# Altium project MiniPTM.PrjPcb (part 3 of 3)

## Sheet 13-Power-P3V3.SchDoc
size B; SheetNumber: 12; SheetTotal: 14; SPICEModelCacheMBQUAUON: <root> / <DocumentId>MBQUAUON</DocumentId> / <CacheFrame Number="0"> / <Model Name="emk105bj105_v-f" Kind="CKT"> / <Text>* EMK105BJ105_V-F     SPICE MODEL  ( General Type ) / *-------------------------------------------------------------------------------------------------------- / * Model Generated by TAIYO YUDEN Corporation (http://www.ty-top.com) / * Version 1.0 / * TAIYO YUDEN Control No. 170508_130520 / * Copyright(c) 2012 TAIYO YUDEN CO.,LTD. All Rights Reserved. / *-------------------------------------------------------------------------------------------------------- / * / * Products Name : Multilayer Ceramic Capacitors / * / * Characteristics : / *     Capacitance : 1 uF , Rated Voltage : 16V , TCC : X5R / *     Case Size : 1.0 x 0.5 / 0.039 x 0.02 [mm/inch] , Thickness : 0.5 / 0.02 [mm/inch] / *     (Conditions: Temperature = 25 degC , DC Bias Current/Voltage = 0A / 0V) / * / * Frequency Range : 40Hz - 3GHz / * / * External Node Assignments : / * / *  1  o---| |---o  2 / * / *-------------------------------------------------------------------------------------------------------- / .SubCkt EMK105BJ105_V-F 1 2 / **************************** / C0 1 110 0.68309u / Cm 1 101 0.26053u / C1 101 102 0.94076u / Rc1 101 102 1.9029k / C2 102 103 0.66707u / Rc2 102 103 120.36 / C3 103 110 0.57203u / Rc3 103 110 2.1097 / C2m 1 301 0.1871u / C21 301 302 3.2494u / Rc21 301 302 1.1117k / C22 302 303 2.1014u / Rc22 302 303 1.484k / C23 303 304 2.1172u / Rc23 303 304 1.3876k / C24 304 305 0.75729u / Rc24 304 305 332.59 / C25 305 306 0.94401u / Rc25 305 306 249.09 / C26 306 307 0.34674u / Rc26 306 307 28.352 / C27 307 308 0.37158u / Rc27 307 308 19.989 / C28 308 309 0.17933u / Rc28 308 309 31.748 / C29 309 110 0.016445u / Rc29 309 110 1.0592 / Rp0 1 110 100Meg / L0 110 120 0.2216n / Lm 120 130 0.1509n / L1 120 121 0.12659n / RL1 121 130 0.85161 / L2 120 122 0.15996n / RL2 122 130 0.42469 / L3 120 123 7.9543n / RL3 123 130 0.54643m / CR 120 124 0.24334u / LR 124 125 0.090738n / RR 125 130 68.076m / CL 130 140 2.7354p / LL 130 140 0.10762n / RL 130 140 50.614 / Rs 140 2 7.5416m / **************************** / .ends EMK105BJ105_V-F</Text> / </Model> / </CacheFrame> / </root>
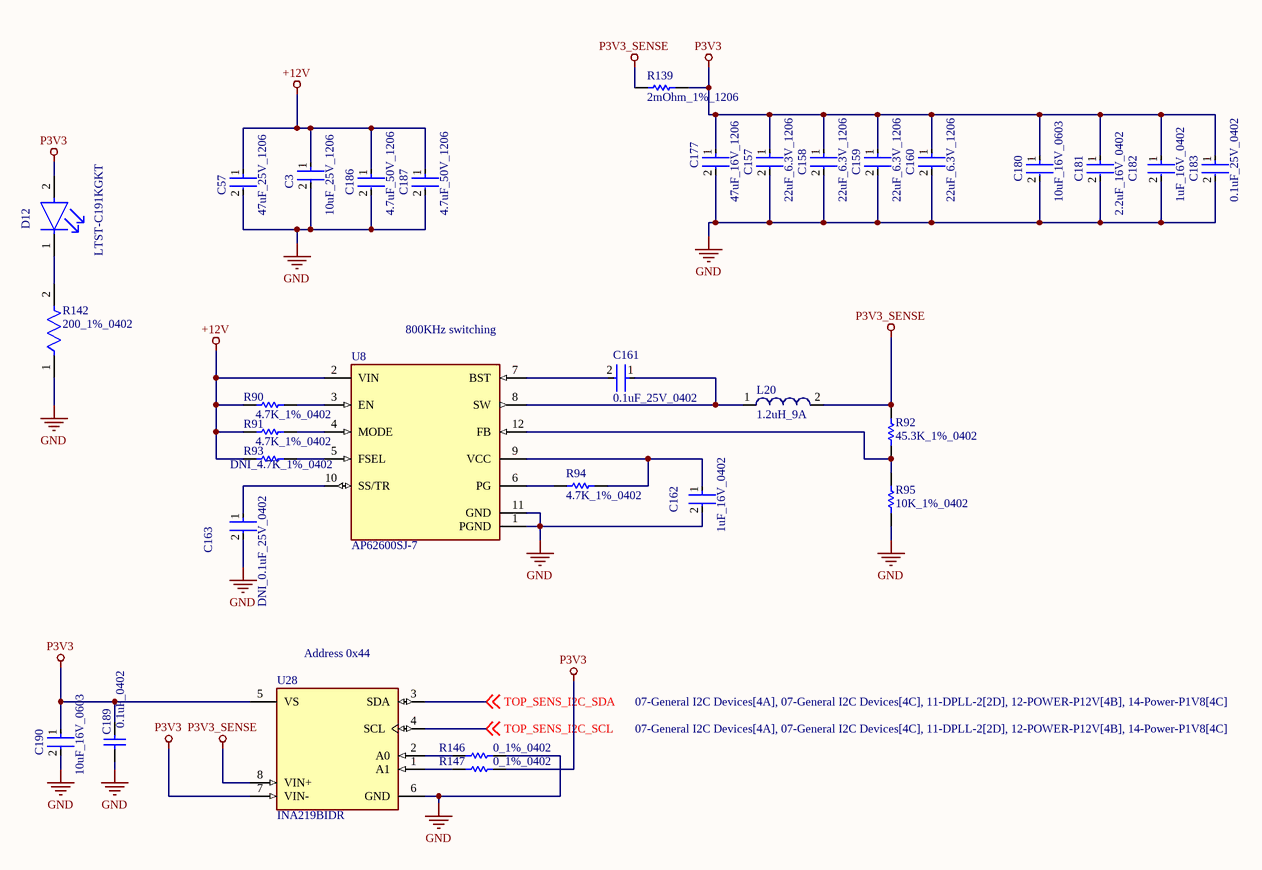
[diagram p11: 13-Power-P3V3.SchDoc]

### Parts
C3  10uF_25V_1206  [FP-1206-L_3_2_0_2-W_1_6_0-IPC_A]
C57  47uF_25V_1206  [FP-C3216-160-0_2-MFG]
C157  22uF_6.3V_1206  [FP-1206-L_3_2_0_2-W_1_6_0-IPC_C]
C158  22uF_6.3V_1206  [FP-1206-L_3_2_0_2-W_1_6_0-IPC_C]
C159  22uF_6.3V_1206  [FP-1206-L_3_2_0_2-W_1_6_0-IPC_C]
C160  22uF_6.3V_1206  [FP-1206-L_3_2_0_2-W_1_6_0-IPC_C]
C161  0.1uF_25V_0402  [FP-0402-L_1_0_1-W_0_5_0_1-IPC_C]
C162  1uF_16V_0402  [FP-0402-L_1_0_0_05-W_0_5-IPC_A]
C163  DNI_0.1uF_25V_0402  [FP-0402-L_1_0_1-W_0_5_0_1-IPC_C]  (no BOM)
C177  47uF_16V_1206  [FP-C3216-160-0_2-MFG]
C180  10uF_16V_0603  [FP-0603-L_1_6_0_2-W_0_8_0-MFG]
C181  2.2uF_16V_0402  [FP-C1005-050-0_05-IPC_A]
C182  1uF_16V_0402  [FP-0402-L_1_0_0_05-W_0_5-IPC_A]
C183  0.1uF_25V_0402  [FP-0402-L_1_0_1-W_0_5_0_1-IPC_C]
C186  4.7uF_50V_1206  [FP-GRM31C-0_2-e0_3_0_8-IPC_C]
C187  4.7uF_50V_1206  [FP-GRM31C-0_2-e0_3_0_8-IPC_C]
C189  0.1uF_0402  [CAPC1005X56X25NL10T15]
C190  10uF_16V_0603  [FP-0603-L_1_6_0_2-W_0_8_0-MFG]
D12  LTST-C191KGKT  [FP-LTST-C191KGKT-MFG]
L20  1.2uH_9A  [WE-LHMI 7050]
R90  4.7K_1%_0402  [RESC1005X40X25NL10T10]
R91  4.7K_1%_0402  [RESC1005X40X25NL10T10]
R92  45.3K_1%_0402  [RESC1005X40X25ML05T10]
R93  DNI_4.7K_1%_0402  [RESC1005X40X25NL10T10]  (no BOM)
R94  4.7K_1%_0402  [RESC1005X40X25NL10T10]
R95  10K_1%_0402  [RESC1005X40X25NL10T10]
R139  2mOhm_1%_1206  [RESC3216X89X64NL25T25]
R142  200_1%_0402  [FP-ERJ2RK-IPC_A]
R146  0_1%_0402  [RESC1005X40X25LL05T05]
R147  0_1%_0402  [RESC1005X40X25LL05T05]
U8  AP62600SJ-7  [FP-V-QFN2030-12_Type_A-MFG]
U28  INA219BIDR  [FP-D0008A-MFG]

### Nets
+12V: C3.1 C57.1 C186.1 C187.1 R90.1 R91.1 R93.1 U8.2(VIN)
GND: C3.2 C57.2 C157.2 C158.2 C159.2 C160.2 C162.2 C163.2 C177.2 C180.2 C181.2 C182.2 C183.2 C186.2 C187.2 C189.1 C190.2 R95.1 R142.1 R146.2 U8.1(PGND) U8.11(GND) U28.6(GND)
P3V3: C157.1 C158.1 C159.1 C160.1 C177.1 C180.1 C181.1 C182.1 C183.1 C189.2 C190.1 D12.2(A) R139.2 R147.2 U28.5(VS) U28.7(VIN-)
P3V3_SENSE: L20.2 R92.2 R139.1 U28.8(VIN+)
TOP_SENS_I2C_SCL: U28.4(SCL) ; off-sheet TOP_SENS_I2C_SCL
TOP_SENS_I2C_SDA: U28.3(SDA) ; off-sheet TOP_SENS_I2C_SDA
NetC161_1: C161.1 L20.1 U8.8(SW)
NetC161_2: C161.2 U8.7(BST)
NetC162_1: C162.1 R94.1 U8.9(VCC)
NetC163_1: C163.1 U8.10(SS/TR)
NetD12_1: D12.1(C) R142.2
NetR90_2: R90.2 U8.3(EN)
NetR91_2: R91.2 U8.4(MODE)
NetR92_1: R92.1 R95.2 U8.12(FB)
NetR93_2: R93.2 U8.5(FSEL)
NetR94_2: R94.2 U8.6(PG)
NetR146_1: R146.1 U28.2(A0)
NetR147_1: R147.1 U28.1(A1)

### Notes on the sheet
- (near U8) 800KHz switching
- (near U28) Address 0x44

### Library data of the parts
C3 = CMP-04427-006943-1: General Purpose Ceramic Capacitor, 1206, 10uF, 20%, X5R, 15%, 25V; Dissipation Factor: 12.5%; Insulation Resistance: 10GR; Case Code (Imperial): 1206; Series: -; Construction: Flat; Termination: SMD/SMT; Case/Package: 1206; Dielectric: X5R; Width: 1.6mm; Max Operating Temperature: 85°C; Height: 0.07mm; Package Quantity: 1; Depth: 1.6mm; Voltage Rating: 25V; Capacitance: 10uF; RoHS Compliant: Yes; Mount: Surface Mount; Radiation Hardening: No; Voltage Rating (DC): 25V; Number of Pins: 2; Contact Plating: Tin; Min Operating Temperature: -55°C; Lead Free: Lead Free; Packaging: Tape and Reel; Tolerance: 20%; Case Code (Metric): 3216; Thickness: 0.07inch; Length: 3.2mm; REACH SVHC: No SVHC
C57 = CMP-2000-05397-3: Multilayer Ceramic Capacitors 47uF ±20% 25V X5R SMD 1206; Weight: 0.000571oz; Dielectric: X5R; Length: 0.126inch; Voltage Rating: 25V; Case/Package: 1206; Dielectric Material: Ceramic; Min Operating Temperature: -55°C; Lead Free: Lead Free; Packaging: Tape and Reel; Package Quantity: 1; Mount: Surface Mount; Depth: 1.6mm; REACH SVHC: No SVHC; Termination: SMD/SMT; Case Code (Imperial): 1206; Series: C; Resistor Type: Ceramic; Voltage: 25V; Width: 0.063inch; Height: 1.6mm; Tolerance: 20%; Capacitance: 47uF; Max Operating Temperature: 85°C; Voltage Rating (DC): 25V; RoHS Compliant: Yes; Thickness: 0.071inch; Case Code (Metric): 3216
C157-C160 = CMP-2000-05869-2: General Purpose Ceramic Capacitor, 1206, 22uF, 20%, X5R, 15%, 6.3V; Lead Free: Lead Free; Case Code (Metric): 3216; Case/Package: 1206; Depth: 1.6mm; Capacitance: 22uF; Length: 3.2mm; Series: -; Contact Plating: Tin; Tolerance: 20%; REACH SVHC: No SVHC; Radiation Hardening: No; RoHS Compliant: Yes; Termination: SMD/SMT; Voltage Rating: 6.3V; Packaging: Tape and Reel; Voltage: 6.3V; Mount: Surface Mount; Thickness: 0.07inch; Package Quantity: 1; Voltage Rating (DC): 6.3V; Case Code (Imperial): 1206; Construction: Flat; Dielectric: X5R; Number of Pins: 2; Min Operating Temperature: -55°C; Height: 0.07mm; Width: 0.063inch; Max Operating Temperature: 85°C
C161 C163 C183 = CMP-2008-02519-2: General Purpose Ceramic Capacitor, 0402, 100nF, 10%, X7R, 15%, 25V; Package Quantity: 1; Capacitance: 100nF; Min Operating Temperature: -55°C; Voltage: 25V; Voltage Rating: 25V; Construction: Flat; Max Operating Temperature: 125°C; Radiation Hardening: No; Depth: 0.5mm; Thickness: 0.022inch; Voltage Rating (DC): 25V; Number of Pins: 2; Lead Free: Lead Free; Series: -; REACH SVHC: No SVHC; Length: 1mm; Dielectric: X7R; RoHS Compliant: Yes; Mount: Surface Mount; Packaging: Tape and Reel; Case/Package: 0402; Case Code (Imperial): 0402; Termination: SMD/SMT; Width: 0.02inch; Case Code (Metric): 1005; Tolerance: 10%
C162 C182 = CMP-14477-000104-2: None; Tolerance: 10%; Voltage Rating: 16V; Dielectric: X5R; Capacitance: 1uF; Packaging: Tape and Reel; Depth: 0.5mm; Mount: Surface Mount; Thickness: 0.022inch; Package Quantity: 1; Min Operating Temperature: -55°C; Series: M; Voltage Rating (DC): 16V; Termination: SMD/SMT; Case/Package: 0402; Number of Pins: 2; Case Code (Imperial): 0402; Length: 1mm; Halogen Free: Halogen Free; Case Code (Metric): 1005; Width: 0.02inch; RoHS Compliant: Yes; Radiation Hardening: No; Max Operating Temperature: 85°C; Height: 0.5mm; Construction: Flat
C177 = CMP-2000-07442-2: Multilayer Ceramic Capacitors 47uF ±20% 16V X5R SMD 1206; Resistor Type: Ceramic; Width: 0.063inch; Case Code (Imperial): 1206; Radiation Hardening: No; Thickness: 0.071inch; Dielectric: X5R; Weight: 0.000571oz; Termination: SMD/SMT; Dielectric Material: Ceramic; Min Operating Temperature: -55°C; Depth: 1.6mm; Case Code (Metric): 3216; Max Operating Temperature: 85°C; RoHS Compliant: Yes; REACH SVHC: No SVHC; Mount: Surface Mount; Lead Free: Lead Free; Height: 1.6mm; Length: 3.2mm; Tolerance: 20%; Voltage Rating (DC): 16V; Capacitance: 47uF; Package Quantity: 1; Construction: Flat; Packaging: Tape and Reel; Series: C; Case/Package: 1206; Voltage Rating: 16V
C180 C190 = CMP-2000-06226-4: Multilayer Ceramic Capacitor 10uF 16V X5R 20% SMD 0603 T/R; Packaging: Tape and Reel; Construction: Flat; Height: 0.8mm; Max Operating Temperature: 85°C; Dielectric: X5R; Case Code (Metric): 1608; Voltage Rating (DC): 16V; Width: 0.031inch; Voltage Rating: 16V; Length: 0.063inch; RoHS Compliant: Yes; Halogen Free: Halogen Free; Case Code (Imperial): 0603; Capacitance: 10uF; Mount: Surface Mount; Thickness: 0.031inch; Tolerance: 20%; Min Operating Temperature: -55°C; Series: M; Termination: SMD/SMT; Case/Package: 0603; Package Quantity: 1
C181 = CMP-2000-05998-2: Multilayer Ceramic Capacitors 2.2μF ±10% 16V X5R SMD 0402; Capacitance: 2.2uF; REACH SVHC: No SVHC; Series: C; Termination: SMD/SMT; Case Code (Imperial): 0402; Depth: 0.5mm; Mount: Surface Mount; Width: 0.02inch; Package Quantity: 1; Dielectric Material: Ceramic; Length: 1mm; Packaging: Tape and Reel; Case Code (Metric): 1005; RoHS Compliant: Yes; Dielectric: X5R; Max Operating Temperature: 85°C; Lead Free: Lead Free; Weight: 2.3E-05oz; Thickness: 0.022inch; Voltage Rating (DC): 16V; Tolerance: 10%; Voltage Rating: 16V; Resistor Type: Ceramic; Height: 0.5mm; Case/Package: 0402; Min Operating Temperature: -55°C
C186 C187 = CMP-1037-04923-3: Chip Multilayer Ceramic Capacitors for General Purpose, 1206, 4.7uF, X7R, 15%, 10%, 50V; Height: 1.6mm; Voltage: 50V; Capacitance: 4.7uF; Lead Free: Lead Free; Max Operating Temperature: 125°C; Packaging: Tape and Reel; REACH SVHC: No SVHC; Voltage Rating: 50V; Mount: Surface Mount; Termination: SMD/SMT; Tolerance: 10%; Case/Package: 1206; Material: Ceramic; Depth: 1.6mm; Length: 3.2mm; Case Code (Metric): 3216; Voltage Rating (DC): 50V; Case Code (Imperial): 1206; Radiation Hardening: No; Width: 0.063inch; Thickness: 0.071inch; Package Quantity: 2000; Min Operating Temperature: -55°C; Dielectric: X7R
C189 = CMP-2008-00031-1: Part Number: LD02YD104KAB2A; Manufacturer: AVX Interconnect / Elco
D12 = CMP-2000-05198-2: LED GREEN CLEAR SMD; Max Power Dissipation: 75mW; Forward Current: 30mA; Reverse Voltage: 5V; Lens Color: Colorless; Forward Voltage: 2V; Dominant Wavelength: 571nm; Number of LEDs: 1; Viewing Angle: 130°; Lens Style: Rectangular; Test Current: 20mA; Luminous Intensity: 35mcd; Wavelength: 574nm; Width: 0.8mm; Case Code (Imperial): 0603; Number of Pins: 2; Lead Free: Lead Free; Packaging: Tape and Reel; Package Quantity: 1; Min Operating Temperature: -55°C; Case/Package: 0603; Length: 1.6mm; Power Dissipation: 75mW; Depth: 0.8mm; Radiation Hardening: No; Mount: Surface Mount; Max Operating Temperature: 85°C; Color: Green; Power Rating: 75mW; Height: 0.55mm; Illumination Color: Green; Case Code (Metric): 1608; Lens Transparency: Clear; Number of Elements: 1
L20 = CMP-1353-00066-2: SMD Power Inductor WE-LHMI, L=1.2 µH; Manufacturer: Wuerth Elektronik; PartNumber: 74437349012; Inductance: 1.2 ÂµH; ComponentLink1Description: Manufacturer URL; ComponentLink2URL: http://katalog.we-online.de/kataloge/eisos/media/pdf/74437349012.pdf; ComponentLink1URL: http://www.we-online.com; PackageReference: WE-LHMI 7050; ComponentLink2Description: Datasheet
R90 R91 R93 R94 = CMP-2002-05217-1: as R82-R84 on sheet 11-DPLL-2
R92 = CMP-2002-07692-1: Part Number: RC0402FR-0745K3L; Manufacturer: Yageo / Phycomp
R95 = CMP-2002-04694-1: Manufacturer: Bourns; Part Number: CR0402-FX-1002GLF
R139 = CMP-2003-04334-1: Manufacturer: Vishay Dale; Part Number: WSL12062L000FEA18
R142 = CMP-2002-00757-2: RES SMD 200 OHM 1% 1/10W 0402; Power Rating: 100mW; Voltage Rating (DC): 50V; Resistance: 200R; Temperature Coefficient: 100ppm/°C; RoHS Compliant: Yes; Packaging: Tape and Reel; Case Code (Metric): 1005; Package Quantity: 1; Contact Plating: Tin; Series: ERJ; Mount: Surface Mount; Lead Free: Lead Free; Min Operating Temperature: -55°C; Number of Terminations: 2; Max Power Dissipation: 100mW; Technology: THICK FILM; Voltage Rating: 50V; Case/Package: 0402; Width: 0.02inch; Termination: SMD/SMT; Military Standard: Not; Height: 0.35mm; Radiation Hardening: No; Resistance Tolerance: 1%; Length: 1mm; REACH SVHC: No SVHC; Construction: Rectangular; Depth: 0.5mm; Features: Automotive AEC-Q200; Resistor Type: Thick Film; Case Code (Imperial): 0402; Tolerance: 1%; Size Code: 0402; Max Operating Temperature: 155°C
R146 R147 = CMP-2000-07451-1: Chip Resistor, 0 Ohm, 0.1 W, -55 to 155 degC, 0402 (1005 Metric), RoHS, Tape and Reel; Manufacturer: Panasonic; Voltage Rating (DC): 50V; Temperature Coefficient: 600ppm/��C; Max Power Dissipation: 100mW; Resistance: 0mOhm; Tolerance: 5%; Number of Terminations: 2; Mount: SurfaceMount; Height: 0.35mm; Packaging: TapeandReel; Contact Plating: Tin; Manufacturer URL: http://www.panasonic.com/; Composition: ThickFilm; Max Operating Temperature: 155degC; REACH SVHC: NoSVHC; Case/Package: 0402; Package Reference: 402; Depth: 0.5mm; Package Description: 2-Pin Surface Mount Device, Body 1 x 0.5 mm; Datasheet URL: https://industrial.panasonic.com/cdbs/www-data/pdf/RDA0000/AOA0000C301.pdf; RoHSCompliant: True; Case Code (Imperial): 0402; Military Standard: Not; Min Operating Temperature: -55degC; Power Rating: 100mW; Datasheet Version: 03/2015; Length: 1mm; Case Code (Metric): 1005; Termination: SMD/SMT; Mounting Technology: SurfaceMount; Voltage Rating: 50V; Width: 0.02inch; Package Quantity: 1; Lead Free: LeadFree; Radiation Hardening: No
U8 = CMP-12757-000022-1: DCDC CONV HV BUCK,V-QFN2030-12; RoHS Compliant: Yes
U28 = CMP-0704-00005-3: IC MONITOR PWR/CURR BIDIR 8-SOIC; Min Supply Voltage: 3V; Common Mode Rejection Ratio: 100dB; Output Current: 10mA; Number of Amplifiers: 1; Accuracy: 0.5%; Supply Current: 1mA; Quiescent Current: 700uA; Bandwidth: 11kHz; Input Offset Voltage (Vos): 40uV; Max Supply Voltage: 5.5V; Packaging: Tape and Reel; REACH SVHC: No SVHC; Max Operating Temperature: 125°C; Number of Pins: 8; Lead Free: Lead Free; Package Quantity: 1; Radiation Hardening: No; Case/Package: SOIC; Min Operating Temperature: -40°C; Contact Plating: Gold; Series: Zero-Drift; Nominal Supply Current: 1mA; RoHS Compliant: Yes

## Sheet 14-Power-P1V8.SchDoc
size B; SheetNumber: 12; SheetTotal: 12; SPICEModelCachePRDMSQGY: <root> / <DocumentId>PRDMSQGY</DocumentId> / <CacheFrame Number="0"> / <Model Name="emk105bj105_v-f" Kind="CKT"> / <Text>* EMK105BJ105_V-F     SPICE MODEL  ( General Type ) / *-------------------------------------------------------------------------------------------------------- / * Model Generated by TAIYO YUDEN Corporation (http://www.ty-top.com) / * Version 1.0 / * TAIYO YUDEN Control No. 170508_130520 / * Copyright(c) 2012 TAIYO YUDEN CO.,LTD. All Rights Reserved. / *-------------------------------------------------------------------------------------------------------- / * / * Products Name : Multilayer Ceramic Capacitors / * / * Characteristics : / *     Capacitance : 1 uF , Rated Voltage : 16V , TCC : X5R / *     Case Size : 1.0 x 0.5 / 0.039 x 0.02 [mm/inch] , Thickness : 0.5 / 0.02 [mm/inch] / *     (Conditions: Temperature = 25 degC , DC Bias Current/Voltage = 0A / 0V) / * / * Frequency Range : 40Hz - 3GHz / * / * External Node Assignments : / * / *  1  o---| |---o  2 / * / *-------------------------------------------------------------------------------------------------------- / .SubCkt EMK105BJ105_V-F 1 2 / **************************** / C0 1 110 0.68309u / Cm 1 101 0.26053u / C1 101 102 0.94076u / Rc1 101 102 1.9029k / C2 102 103 0.66707u / Rc2 102 103 120.36 / C3 103 110 0.57203u / Rc3 103 110 2.1097 / C2m 1 301 0.1871u / C21 301 302 3.2494u / Rc21 301 302 1.1117k / C22 302 303 2.1014u / Rc22 302 303 1.484k / C23 303 304 2.1172u / Rc23 303 304 1.3876k / C24 304 305 0.75729u / Rc24 304 305 332.59 / C25 305 306 0.94401u / Rc25 305 306 249.09 / C26 306 307 0.34674u / Rc26 306 307 28.352 / C27 307 308 0.37158u / Rc27 307 308 19.989 / C28 308 309 0.17933u / Rc28 308 309 31.748 / C29 309 110 0.016445u / Rc29 309 110 1.0592 / Rp0 1 110 100Meg / L0 110 120 0.2216n / Lm 120 130 0.1509n / L1 120 121 0.12659n / RL1 121 130 0.85161 / L2 120 122 0.15996n / RL2 122 130 0.42469 / L3 120 123 7.9543n / RL3 123 130 0.54643m / CR 120 124 0.24334u / LR 124 125 0.090738n / RR 125 130 68.076m / CL 130 140 2.7354p / LL 130 140 0.10762n / RL 130 140 50.614 / Rs 140 2 7.5416m / **************************** / .ends EMK105BJ105_V-F</Text> / </Model> / </CacheFrame> / </root>
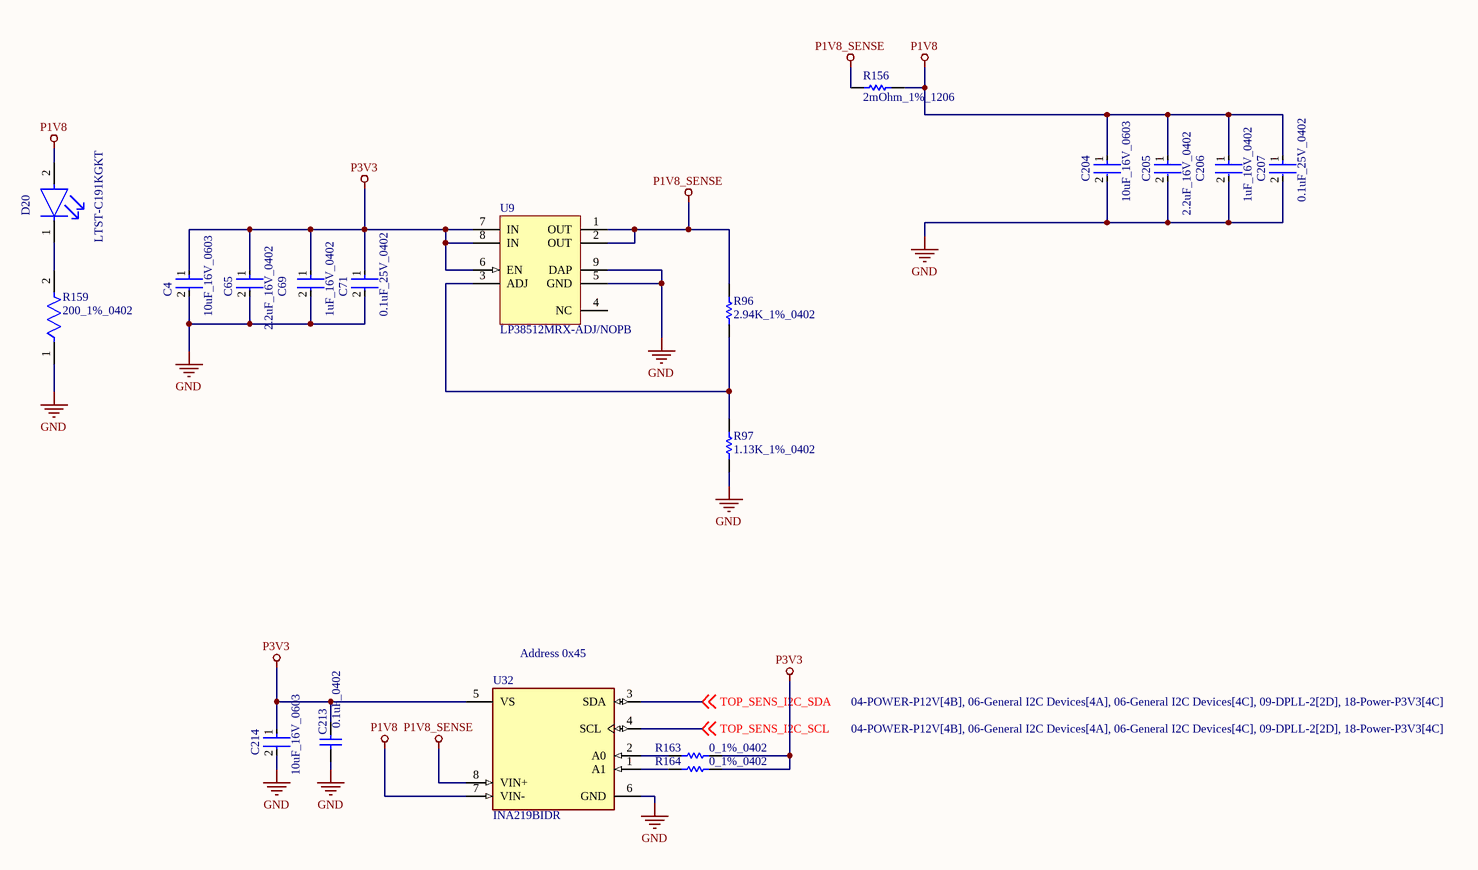
[diagram p12: 14-Power-P1V8.SchDoc]

### Parts
C4  10uF_16V_0603  [FP-0603-L_1_6_0_2-W_0_8_0-MFG]
C65  2.2uF_16V_0402  [FP-C1005-050-0_05-IPC_A]
C69  1uF_16V_0402  [FP-0402-L_1_0_0_05-W_0_5-IPC_A]
C71  0.1uF_25V_0402  [FP-0402-L_1_0_1-W_0_5_0_1-IPC_C]
C204  10uF_16V_0603  [FP-0603-L_1_6_0_2-W_0_8_0-MFG]
C205  2.2uF_16V_0402  [FP-C1005-050-0_05-IPC_A]
C206  1uF_16V_0402  [FP-0402-L_1_0_0_05-W_0_5-IPC_A]
C207  0.1uF_25V_0402  [FP-0402-L_1_0_1-W_0_5_0_1-IPC_C]
C213  0.1uF_0402  [CAPC1005X56X25NL10T15]
C214  10uF_16V_0603  [FP-0603-L_1_6_0_2-W_0_8_0-MFG]
D20  LTST-C191KGKT  [FP-LTST-C191KGKT-MFG]
R96  2.94K_1%_0402  [RESC1005X40X25ML05T10]
R97  1.13K_1%_0402  [RESC1005X40X25NL05T05]
R156  2mOhm_1%_1206  [RESC3216X89X64NL25T25]
R159  200_1%_0402  [FP-ERJ2RK-IPC_A]
R163  0_1%_0402  [RESC1005X40X25LL05T05]
R164  0_1%_0402  [RESC1005X40X25LL05T05]
U9  LP38512MRX-ADJ/NOPB  [MRA08B_M]
U32  INA219BIDR  [FP-D0008A-MFG]

### Nets
GND: C4.2 C65.2 C69.2 C71.2 C204.2 C205.2 C206.2 C207.2 C213.1 C214.2 R97.1 R159.1 U9.5(GND) U9.9(DAP) U32.6(GND)
P1V8: C204.1 C205.1 C206.1 C207.1 D20.2(A) R156.2 U32.7(VIN-)
P1V8_SENSE: R96.2 R156.1 U9.1(OUT) U9.2(OUT) U32.8(VIN+)
P3V3: C4.1 C65.1 C69.1 C71.1 C213.2 C214.1 R163.2 R164.2 U9.6(EN) U9.7(IN) U9.8(IN) U32.5(VS)
TOP_SENS_I2C_SCL: U32.4(SCL) ; off-sheet TOP_SENS_I2C_SCL
TOP_SENS_I2C_SDA: U32.3(SDA) ; off-sheet TOP_SENS_I2C_SDA
NetD20_1: D20.1(C) R159.2
NetR96_1: R96.1 R97.2 U9.3(ADJ)
NetR163_1: R163.1 U32.2(A0)
NetR164_1: R164.1 U32.1(A1)

Not connected (* = marked no-connect by the designer): U9 4(NC)

### Notes on the sheet
- (near U32) Address 0x45

### Library data of the parts
C4 C204 C214 = CMP-2000-06226-4: as C180 on sheet 13-Power-P3V3; Packaging: Tape and Reel; Construction: Flat; Height: 0.8mm; Max Operating Temperature: 85°C; Dielectric: X5R; Case Code (Metric): 1608; Voltage Rating (DC): 16V; Width: 0.031inch; Voltage Rating: 16V; Length: 0.063inch; RoHS Compliant: Yes; Halogen Free: Halogen Free; Case Code (Imperial): 0603; Capacitance: 10uF; Mount: Surface Mount; Thickness: 0.031inch; Tolerance: 20%; Min Operating Temperature: -55°C; Series: M; Termination: SMD/SMT; Case/Package: 0603; Package Quantity: 1
C65 C205 = CMP-2000-05998-2: as C181 on sheet 13-Power-P3V3; REACH SVHC: No SVHC; Series: C; Termination: SMD/SMT; Case Code (Imperial): 0402; Depth: 0.5mm; Mount: Surface Mount; Width: 0.02inch; Package Quantity: 1; Dielectric Material: Ceramic; Length: 1mm; Packaging: Tape and Reel; Case Code (Metric): 1005; RoHS Compliant: Yes; Dielectric: X5R; Max Operating Temperature: 85°C; Lead Free: Lead Free; Weight: 2.3E-05oz; Thickness: 0.022inch; Voltage Rating (DC): 16V; Tolerance: 10%; Voltage Rating: 16V; Resistor Type: Ceramic; Height: 0.5mm; Case/Package: 0402; Min Operating Temperature: -55°C
C69 C206 = CMP-14477-000104-2: as C162 on sheet 13-Power-P3V3; Packaging: Tape and Reel; Depth: 0.5mm; Mount: Surface Mount; Thickness: 0.022inch; Package Quantity: 1; Min Operating Temperature: -55°C; Series: M; Voltage Rating (DC): 16V; Termination: SMD/SMT; Case/Package: 0402; Number of Pins: 2; Case Code (Imperial): 0402; Length: 1mm; Halogen Free: Halogen Free; Case Code (Metric): 1005; Width: 0.02inch; RoHS Compliant: Yes; Radiation Hardening: No; Max Operating Temperature: 85°C; Height: 0.5mm; Construction: Flat
C71 C207 = CMP-2008-02519-2: as C161 on sheet 13-Power-P3V3; Package Quantity: 1; Capacitance: 100nF; Min Operating Temperature: -55°C; Voltage: 25V; Voltage Rating: 25V; Construction: Flat; Max Operating Temperature: 125°C; Radiation Hardening: No; Depth: 0.5mm; Thickness: 0.022inch; Voltage Rating (DC): 25V; Number of Pins: 2; Lead Free: Lead Free; Series: -; REACH SVHC: No SVHC; Length: 1mm; Dielectric: X7R; RoHS Compliant: Yes; Mount: Surface Mount; Packaging: Tape and Reel; Case/Package: 0402; Case Code (Imperial): 0402; Termination: SMD/SMT; Width: 0.02inch; Case Code (Metric): 1005; Tolerance: 10%
C213 = CMP-2008-00031-1: as C189 on sheet 13-Power-P3V3
D20 = CMP-2000-05198-2: as D12 on sheet 13-Power-P3V3; Width: 0.8mm; Case Code (Imperial): 0603; Number of Pins: 2; Lead Free: Lead Free; Packaging: Tape and Reel; Package Quantity: 1; Min Operating Temperature: -55°C; Case/Package: 0603; Length: 1.6mm; Power Dissipation: 75mW; Depth: 0.8mm; Radiation Hardening: No; Mount: Surface Mount; Max Operating Temperature: 85°C; Color: Green; Power Rating: 75mW; Height: 0.55mm; Illumination Color: Green; Case Code (Metric): 1608; Lens Transparency: Clear; Number of Elements: 1
R96 = CMP-2002-07579-1: Manufacturer: Yageo; Part Number: RC0402FR-072K94L
R97 = CMP-2002-00630-1: Manufacturer: Panasonic; Part Number: ERJ-2RKF1131X
R156 = CMP-2003-04334-1: as R139 on sheet 13-Power-P3V3
R159 = CMP-2002-00757-2: as R142 on sheet 13-Power-P3V3; RoHS Compliant: Yes; Packaging: Tape and Reel; Case Code (Metric): 1005; Package Quantity: 1; Contact Plating: Tin; Series: ERJ; Mount: Surface Mount; Lead Free: Lead Free; Min Operating Temperature: -55°C; Number of Terminations: 2; Max Power Dissipation: 100mW; Technology: THICK FILM; Voltage Rating: 50V; Case/Package: 0402; Width: 0.02inch; Termination: SMD/SMT; Military Standard: Not; Height: 0.35mm; Radiation Hardening: No; Resistance Tolerance: 1%; Length: 1mm; REACH SVHC: No SVHC; Construction: Rectangular; Depth: 0.5mm; Features: Automotive AEC-Q200; Resistor Type: Thick Film; Case Code (Imperial): 0402; Tolerance: 1%; Size Code: 0402; Max Operating Temperature: 155°C
R163 R164 = CMP-2000-07451-1: as R146 on sheet 13-Power-P3V3; Number of Terminations: 2; Mount: SurfaceMount; Height: 0.35mm; Packaging: TapeandReel; Contact Plating: Tin; Manufacturer URL: http://www.panasonic.com/; Composition: ThickFilm; Max Operating Temperature: 155degC; REACH SVHC: NoSVHC; Case/Package: 0402; Package Reference: 402; Depth: 0.5mm; Package Description: 2-Pin Surface Mount Device, Body 1 x 0.5 mm; Datasheet URL: https://industrial.panasonic.com/cdbs/www-data/pdf/RDA0000/AOA0000C301.pdf; RoHSCompliant: True; Case Code (Imperial): 0402; Military Standard: Not; Min Operating Temperature: -55degC; Power Rating: 100mW; Datasheet Version: 03/2015; Length: 1mm; Case Code (Metric): 1005; Termination: SMD/SMT; Mounting Technology: SurfaceMount; Voltage Rating: 50V; Width: 0.02inch; Package Quantity: 1; Lead Free: LeadFree; Radiation Hardening: No
U9 = CMP-0062-01039-2: 1.5A Fast-Transient Response Adjustable Low-Dropout Linear Voltage Regulator, 8-pin PSOP, Pb-Free; Manufacturer: National Semiconductor; CompType: LDO IC; PackageTopMarking: NSXYTT*L38512*-ADJ; PowerWise: N; ComponentLink3URL: http://www.national.com/packaging/folders/mra08b.html; PackageReference: MRA08B; RoHS: Y; DatasheetVersion: Feb-2009; ComponentLink2Description: LP38512 Web Page; PackageDescription: Molded, PSOP .193 x .154 x .058in, 8 Lead, .050in Pitch, Large DAP; ComponentLink1URL: http://www.national.com/ds/LP/LP38512-ADJ.pdf; ComponentLink3Description: MRA08B Package Page; ComponentLink1Description: LP38512 Datasheet; PackageVersion: revB, Dec-2007; ComponentLink2URL: http://www.national.com/pf/LP/LP38512.html; Code_JEDEC: MS-012-AA; PinCount: 8; RevisionNote: Component URLs added
U32 = CMP-0704-00005-3: as U28 on sheet 13-Power-P3V3; Packaging: Tape and Reel; REACH SVHC: No SVHC; Max Operating Temperature: 125°C; Number of Pins: 8; Lead Free: Lead Free; Package Quantity: 1; Radiation Hardening: No; Case/Package: SOIC; Min Operating Temperature: -40°C; Contact Plating: Gold; Series: Zero-Drift; Nominal Supply Current: 1mA; RoHS Compliant: Yes

## Sheet 15-M2_GNSS.SchDoc
size B; SheetNumber: 13; SheetTotal: 13
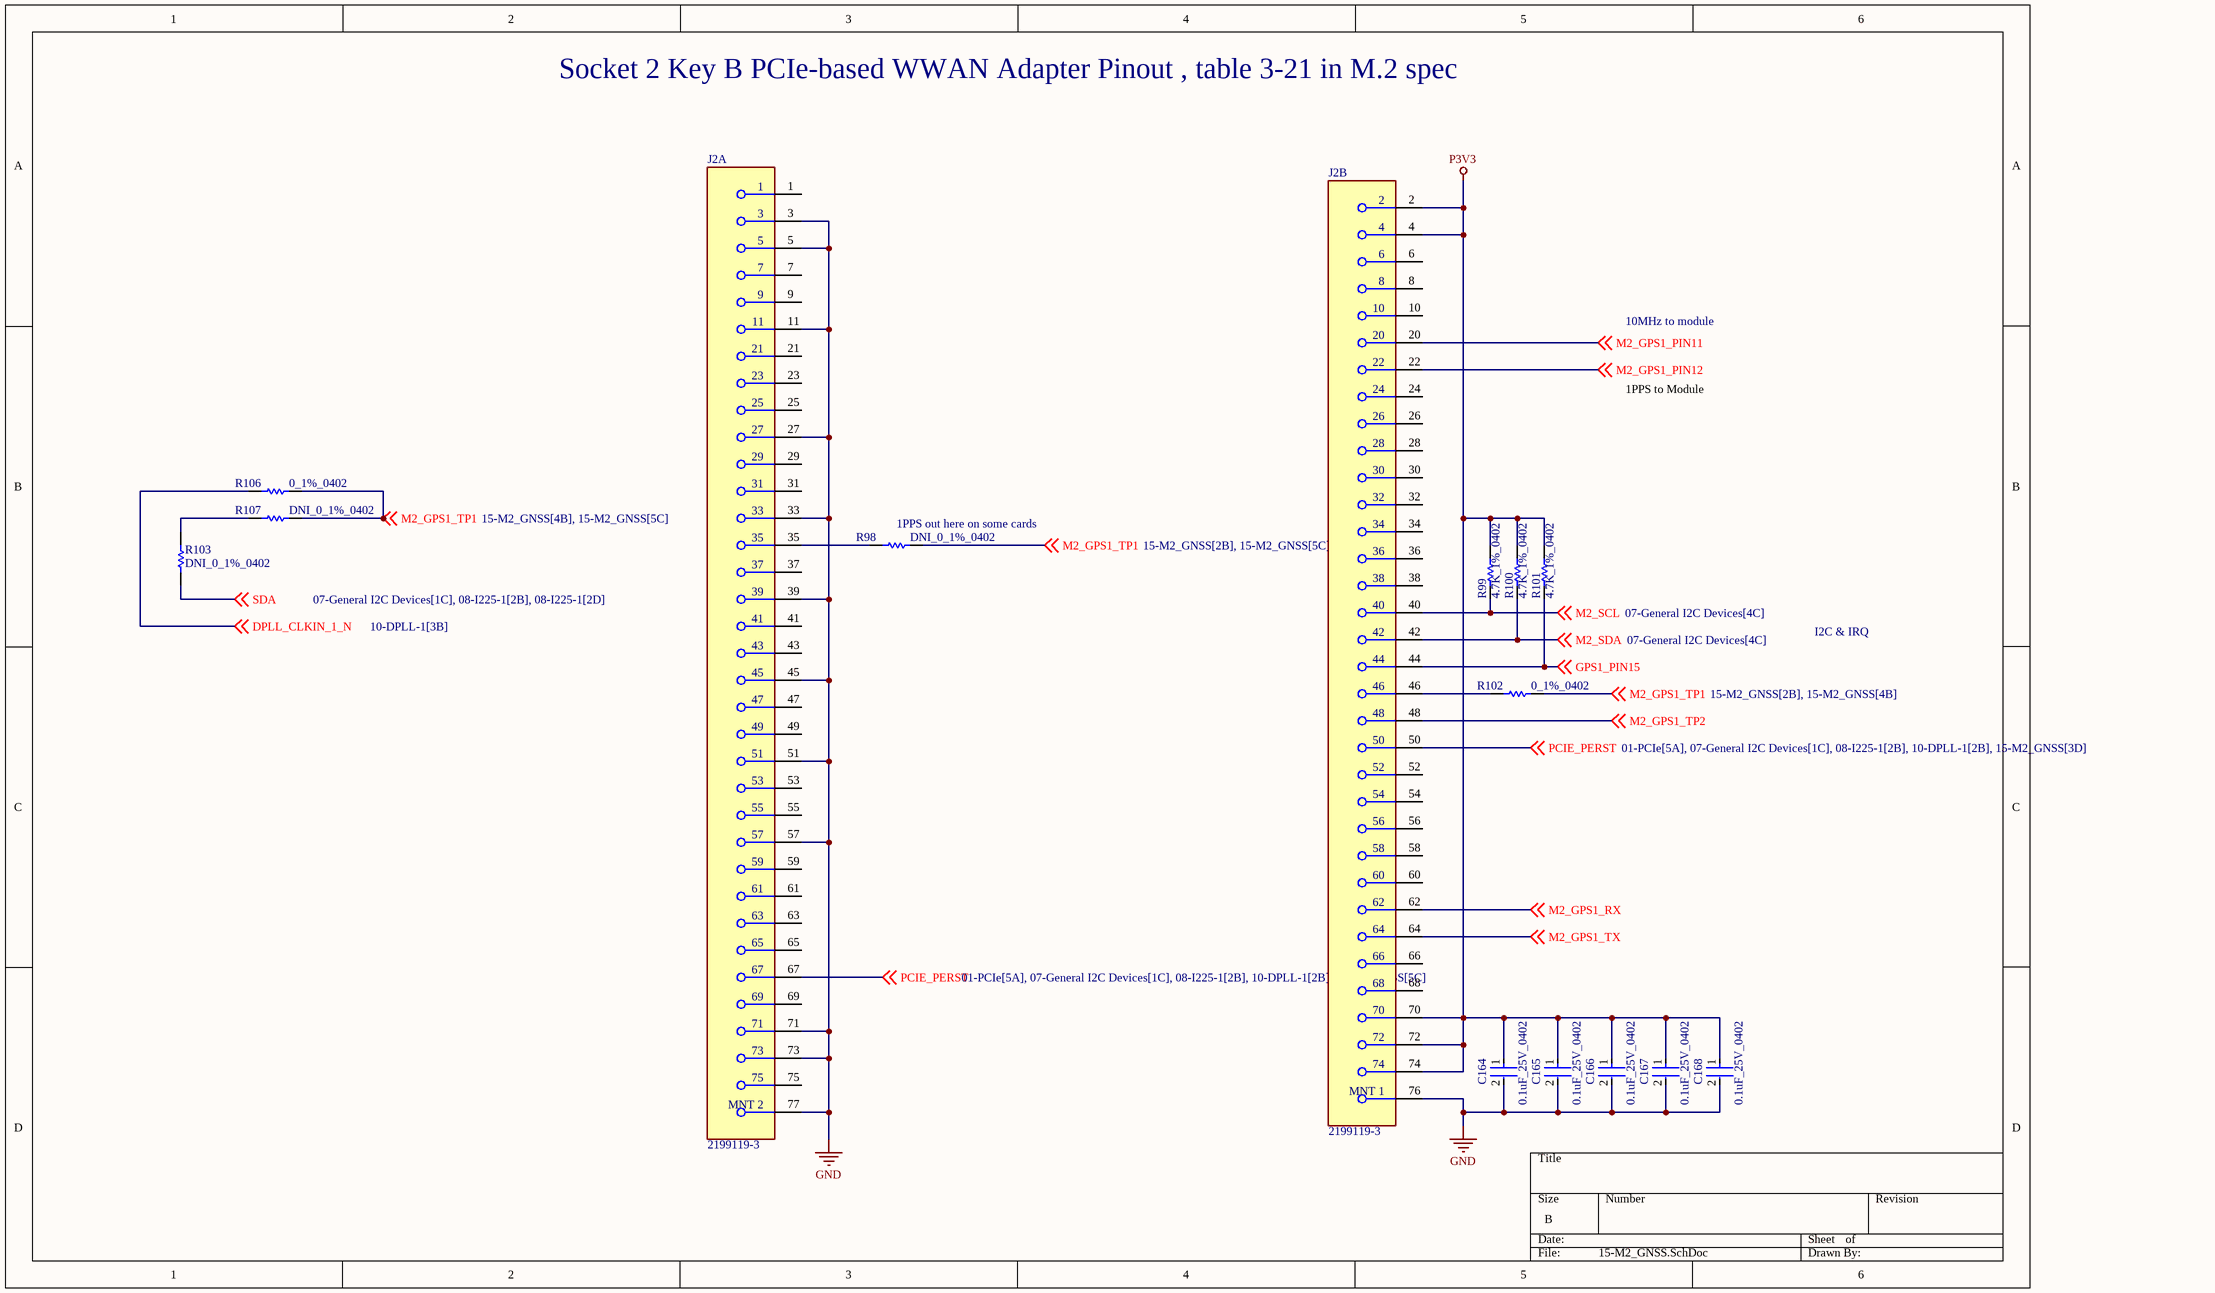
[diagram p13: 15-M2_GNSS.SchDoc]

### Parts
C164  0.1uF_25V_0402  [FP-0402-L_1_0_1-W_0_5_0_1-IPC_C]
C165  0.1uF_25V_0402  [FP-0402-L_1_0_1-W_0_5_0_1-IPC_C]
C166  0.1uF_25V_0402  [FP-0402-L_1_0_1-W_0_5_0_1-IPC_C]
C167  0.1uF_25V_0402  [FP-0402-L_1_0_1-W_0_5_0_1-IPC_C]
C168  0.1uF_25V_0402  [FP-0402-L_1_0_1-W_0_5_0_1-IPC_C]
J2  2199119-3  [FP-2199119-3-MFG]  (parts A,B of 2)
R98  DNI_0_1%_0402  [RESC1005X40X25LL05T05]  (no BOM)
R99  4.7K_1%_0402  [RESC1005X40X25NL10T10]
R100  4.7K_1%_0402  [RESC1005X40X25NL10T10]
R101  4.7K_1%_0402  [RESC1005X40X25NL10T10]
R102  0_1%_0402  [RESC1005X40X25LL05T05]
R103  DNI_0_1%_0402  [RESC1005X40X25LL05T05]  (no BOM)
R106  0_1%_0402  [RESC1005X40X25LL05T05]
R107  DNI_0_1%_0402  [RESC1005X40X25LL05T05]  (no BOM)

### Nets
GND: C164.2 C165.2 C166.2 C167.2 C168.2 J2.3 J2.5 J2.11 J2.27 J2.33 J2.39 J2.45 J2.51 J2.57 J2.71 J2.73 J2.76(MNT_1) J2.77(MNT_2)
P3V3: C164.1 C165.1 C166.1 C167.1 C168.1 J2.2 J2.4 J2.70 J2.72 J2.74 R99.2 R100.2 R101.2
DPLL_CLKIN_1_N: R106.1 ; off-sheet DPLL_CLKIN_1_N
GPS1_PIN15: J2.44 R101.1 ; off-sheet GPS1_PIN15
M2_GPS1_PIN11: J2.20 ; off-sheet M2_GPS1_PIN11
M2_GPS1_PIN12: J2.22 ; off-sheet M2_GPS1_PIN12
M2_GPS1_RX: J2.62 ; off-sheet M2_GPS1_RX
M2_GPS1_TP1: R98.2 R102.2 R106.2 R107.2 ; off-sheet M2_GPS1_TP1
M2_GPS1_TP2: J2.48 ; off-sheet M2_GPS1_TP2
M2_GPS1_TX: J2.64 ; off-sheet M2_GPS1_TX
M2_SCL: J2.40 R99.1 ; off-sheet M2_SCL
M2_SDA: J2.42 R100.1 ; off-sheet M2_SDA
PCIE_PERST: J2.50 J2.67 ; off-sheet PCIE_PERST
SDA: R103.1 ; off-sheet SDA
NetJ2_35: J2.35 R98.1
NetJ2_46: J2.46 R102.1
NetR103_2: R103.2 R107.1

Not connected (* = marked no-connect by the designer): J2 1 6 7 8 9 10 21 23 24 25 26 28 29 30 31 32 34 36 37 38 41 43 47 49 52 53 54 55 56 58 59 60 61 63 65 66 68 69 75

### Notes on the sheet
- Socket 2 Key B PCIe-based WWAN Adapter Pinout , table 3-21 in M.2 spec
- 10MHz to module
- 1PPS to Module
- (near R98) 1PPS out here on some cards
- I2C & IRQ

### Library data of the parts
C164-C168 = CMP-2008-02519-2: as C161 on sheet 13-Power-P3V3; Package Quantity: 1; Capacitance: 100nF; Min Operating Temperature: -55°C; Voltage: 25V; Voltage Rating: 25V; Construction: Flat; Max Operating Temperature: 125°C; Radiation Hardening: No; Depth: 0.5mm; Thickness: 0.022inch; Voltage Rating (DC): 25V; Number of Pins: 2; Lead Free: Lead Free; Series: -; REACH SVHC: No SVHC; Length: 1mm; Dielectric: X7R; RoHS Compliant: Yes; Mount: Surface Mount; Packaging: Tape and Reel; Case/Package: 0402; Case Code (Imperial): 0402; Termination: SMD/SMT; Width: 0.02inch; Case Code (Metric): 1005; Tolerance: 10%
J2 = CMP-03365-000004-1: CONN M.2 FEMALE 67POS 0.020 GOLD; Contact Current Rating: 500mA; Number of Contacts: 67; PCB Mounting Orientation: Right Angle; Pitch: 0.5mm; Voltage Rating: 50V; Insulation Resistance: 500MR; Row Spacing: 7.55mm; Orientation: Right Angle; Length: 0.862inch; Radiation Hardening: No; Mount: Surface Mount; Contact Plating: Gold; Contact Material: Copper Alloy; Width: 8.7mm; Number of Rows: 2; Color: Black; ELV: Compliant; Housing Color: Black; Number of Positions: 67; Housing Material: Thermoplastic; Gender: Female; Min Operating Temperature: -40°C; Max Operating Temperature: 80°C; RoHS Compliant: Yes; Package Quantity: 1200; Packaging: Tape and Reel; Height: 3.2mm; Termination: Solder; Insulation Material: Thermoplastic; Max Voltage Rating (AC): 50V; Current Rating: 500mA
R98 R102 R103 R106 R107 = CMP-2000-07451-1: as R146 on sheet 13-Power-P3V3; Number of Terminations: 2; Mount: SurfaceMount; Height: 0.35mm; Packaging: TapeandReel; Contact Plating: Tin; Manufacturer URL: http://www.panasonic.com/; Composition: ThickFilm; Max Operating Temperature: 155degC; REACH SVHC: NoSVHC; Case/Package: 0402; Package Reference: 402; Depth: 0.5mm; Package Description: 2-Pin Surface Mount Device, Body 1 x 0.5 mm; Datasheet URL: https://industrial.panasonic.com/cdbs/www-data/pdf/RDA0000/AOA0000C301.pdf; RoHSCompliant: True; Case Code (Imperial): 0402; Military Standard: Not; Min Operating Temperature: -55degC; Power Rating: 100mW; Datasheet Version: 03/2015; Length: 1mm; Case Code (Metric): 1005; Termination: SMD/SMT; Mounting Technology: SurfaceMount; Voltage Rating: 50V; Width: 0.02inch; Package Quantity: 1; Lead Free: LeadFree; Radiation Hardening: No
R99-R101 = CMP-2002-05217-1: as R82-R84 on sheet 11-DPLL-2

## Nets that join several sheets
+12V: 12-POWER-P12V (8 pins), 13-Power-P3V3 (8 pins)
+12V_PCIE: 01-PCIe (5 pins), 12-POWER-P12V (CR1.1 R44.1)
DPLL_VDD_CLKA: 10-DPLL-1 (U7.71), 11-DPLL-2 (C134.1 C135.1 L15.2)
DPLL_VDD_CLKB: 10-DPLL-1 (U7.19), 11-DPLL-2 (C120.1 C121.1 L11.2)
DPLL_VDD_DCO_Q0123: 10-DPLL-1 (U7.62), 11-DPLL-2 (C102.1 C103.1 L6.2)
DPLL_VDD_DCO_Q4567: 10-DPLL-1 (U7.30), 11-DPLL-2 (C113.1 C114.1 L9.2)
DPLL_VDD_DIA_A: 10-DPLL-1 (U7.63), 11-DPLL-2 (C77.1 C78.1 L3.2)
DPLL_VDD_DIA_B: 10-DPLL-1 (U7.29), 11-DPLL-2 (C92.1 C93.1 L4.2)
DPLL_VDD_DIG: 10-DPLL-1 (U7.9), 11-DPLL-2 (5 pins)
DPLL_VDD_GPIO: 10-DPLL-1 (U7.46), 11-DPLL-2 (5 pins)
DPLL_VDDA_BG_LC: 10-DPLL-1 (U7.25 U7.26), 11-DPLL-2 (C83.1 C84.1 C85.1 L2.2)
DPLL_VDDA_FB: 10-DPLL-1 (U7.69), 11-DPLL-2 (C125.1 C126.1 L13.2)
DPLL_VDDA_PDCP_XTAL: 10-DPLL-1 (U7.68), 11-DPLL-2 (C99.1 C100.1 L5.2)
DPLL_VDDO_Q0: 10-DPLL-1 (U7.61), 11-DPLL-2 (C111.1 C112.1 L8.2)
DPLL_VDDO_Q1: 10-DPLL-1 (U7.55), 11-DPLL-2 (C127.1 C128.1 L12.2)
DPLL_VDDO_Q2: 10-DPLL-1 (U7.54), 11-DPLL-2 (C139.1 C140.1 L16.2)
DPLL_VDDO_Q3: 10-DPLL-1 (U7.50), 11-DPLL-2 (C148.1 C149.1 L18.2)
DPLL_VDDO_Q4: 10-DPLL-1 (U7.42), 11-DPLL-2 (C106.1 C107.1 L7.2)
DPLL_VDDO_Q5: 10-DPLL-1 (U7.38), 11-DPLL-2 (C118.1 C119.1 L10.2)
DPLL_VDDO_Q6: 10-DPLL-1 (U7.37), 11-DPLL-2 (C132.1 C133.1 L14.2)
DPLL_VDDO_Q7: 10-DPLL-1 (U7.31), 11-DPLL-2 (C143.1 C144.1 L17.2)
GND: 01-PCIe (21 pins), 02-USER_IO (20 pins), 05-Front Panel SFP_1 (62 pins), 06-Front Panel SFP_2 (52 pins), 07-General I2C Devices (9 pins), 08-I225-1 (13 pins), 09-I225-2 (27 pins), 10-DPLL-1 (12 pins), 11-DPLL-2 (82 pins), 12-POWER-P12V (14 pins), 13-Power-P3V3 (23 pins), 14-Power-P1V8 (15 pins), 15-M2_GNSS (18 pins)
P0V95_I225: 08-I225-1 (7 pins), 09-I225-2 (11 pins)
P1V8: 11-DPLL-2 (13 pins), 14-Power-P1V8 (7 pins)
P3V3: 01-PCIe (R22.2), 02-USER_IO (8 pins), 03-USER_IO_STATUS (D3.2 D9.2 D10.2 D11.2), 05-Front Panel SFP_1 (30 pins), 06-Front Panel SFP_2 (30 pins), 07-General I2C Devices (16 pins), 08-I225-1 (12 pins), 09-I225-2 (18 pins), 10-DPLL-1 (D4.2 R58.2 R70.1 R71.1), 11-DPLL-2 (43 pins), 12-POWER-P12V (C19.2 C20.1 U2.5), 13-Power-P3V3 (16 pins), 14-Power-P1V8 (12 pins), 15-M2_GNSS (13 pins)
ANT1_IO_SEL: 02-USER_IO (R14.2 U1.10), 10-DPLL-1 (U7.64)
ANT2_IO_SEL: 02-USER_IO (R29.2 U4.10), 10-DPLL-1 (U7.47)
DPLL_CLKIN_0_N: 05-Front Panel SFP_1 (C173.2), 10-DPLL-1 (U7.2)
DPLL_CLKIN_0_P: 05-Front Panel SFP_1 (C172.2), 10-DPLL-1 (U7.1)
DPLL_CLKIN_1_N: 10-DPLL-1 (U7.4), 15-M2_GNSS (R106.1)
DPLL_CLKIN_1_P: 02-USER_IO (R109.1 R111.2), 10-DPLL-1 (U7.3)
DPLL_CLKIN_2_N: 05-Front Panel SFP_1 (C178.2), 10-DPLL-1 (U7.6)
DPLL_CLKIN_2_P: 05-Front Panel SFP_1 (C176.2), 10-DPLL-1 (U7.5)
DPLL_CLKIN_3_P: 02-USER_IO (R122.2 R129.1), 10-DPLL-1 (U7.7)
DPLL_CLKIN_4_N: 06-Front Panel SFP_2 (C191.2), 10-DPLL-1 (U7.12)
DPLL_CLKIN_4_P: 06-Front Panel SFP_2 (C188.2), 10-DPLL-1 (U7.11)
DPLL_CLKIN_5_N: 01-PCIe (C45.2), 10-DPLL-1 (U7.14)
DPLL_CLKIN_5_P: 01-PCIe (C44.2), 10-DPLL-1 (U7.13)
DPLL_CLKIN_6_N: 06-Front Panel SFP_2 (C211.2), 10-DPLL-1 (U7.16)
DPLL_CLKIN_6_P: 06-Front Panel SFP_2 (C210.2), 10-DPLL-1 (U7.15)
DPLL_CLKOUT0_N: 05-Front Panel SFP_1 (C170.2), 10-DPLL-1 (U7.59)
DPLL_CLKOUT0_P: 05-Front Panel SFP_1 (C171.2), 10-DPLL-1 (U7.60)
DPLL_CLKOUT1_N: 02-USER_IO (R69.1), 10-DPLL-1 (U7.57)
DPLL_CLKOUT1_P: 02-USER_IO (R25.1 R110.2), 10-DPLL-1 (U7.56)
DPLL_CLKOUT2_N: 05-Front Panel SFP_1 (C174.2), 10-DPLL-1 (U7.52)
DPLL_CLKOUT2_P: 05-Front Panel SFP_1 (C175.2), 10-DPLL-1 (U7.53)
DPLL_CLKOUT3_N: 02-USER_IO (R25.2 R60.1 R109.2), 08-I225-1 (R31.1), 10-DPLL-1 (U7.48)
DPLL_CLKOUT3_P: 02-USER_IO (R112.2 R125.1), 10-DPLL-1 (U7.49)
DPLL_CLKOUT4_N: 06-Front Panel SFP_2 (C184.2), 10-DPLL-1 (U7.44)
DPLL_CLKOUT4_P: 06-Front Panel SFP_2 (C185.2), 10-DPLL-1 (U7.43)
DPLL_CLKOUT5_N: 02-USER_IO (R76.1), 10-DPLL-1 (U7.40)
DPLL_CLKOUT6_N: 06-Front Panel SFP_2 (C208.2), 10-DPLL-1 (U7.35)
DPLL_CLKOUT6_P: 06-Front Panel SFP_2 (C209.2), 10-DPLL-1 (U7.36)
DPLL_CLKOUT7_N: 08-I225-1 (R30.1), 10-DPLL-1 (U7.33)
DPLL_CLKOUT7_P: 08-I225-1 (R28.1), 10-DPLL-1 (U7.32)
DPLL_OSCI: 10-DPLL-1 (U7.67), 11-DPLL-2 (C152.2)
DPLL_SCL: 07-General I2C Devices (R120.1 U13.11), 10-DPLL-1 (U7.20)
DPLL_SDA: 07-General I2C Devices (R119.1 U13.10), 10-DPLL-1 (U7.21)
DPLL_XO: 10-DPLL-1 (U7.72), 11-DPLL-2 (R81.1)
I225_CLKREQ_N: 08-I225-1 (U5.3), 09-I225-2 (R51.1)
I225_DISABLE_N: 08-I225-1 (U5.2), 09-I225-2 (R54.1 R55.2)
I225_JTAG_CLK: 08-I225-1 (P3.6 U5.29), 09-I225-2 (R57.2)
I225_JTAG_RSTN: 08-I225-1 (P3.7 U5.16), 09-I225-2 (R56.2)
I225_LAN_PWR_GOOD: 08-I225-1 (U5.1), 09-I225-2 (R53.1)
I225_SDP1: 02-USER_IO (R61.1 R125.2 R129.2), 08-I225-1 (P3.8 R45.1)
I225_ULP_WAKE_N: 08-I225-1 (U5.4), 09-I225-2 (R50.1)
I225_WAKE_N: 08-I225-1 (U5.12), 09-I225-2 (R52.1)
LED1: 03-USER_IO_STATUS (R35.1), 10-DPLL-1 (U7.58)
LED2: 03-USER_IO_STATUS (R36.1), 10-DPLL-1 (U7.51)
LED3: 03-USER_IO_STATUS (R38.1), 10-DPLL-1 (U7.45)
LED4: 03-USER_IO_STATUS (R39.1), 10-DPLL-1 (U7.28)
M2_SCL: 07-General I2C Devices (U13.14), 15-M2_GNSS (J2.40 R99.1)
M2_SDA: 07-General I2C Devices (U13.13), 15-M2_GNSS (J2.42 R100.1)
PCIE_GF_I225_0_N: 01-PCIe (P2.B15), 08-I225-1 (R26.1)
PCIE_GF_I225_0_P: 01-PCIe (P2.B14), 08-I225-1 (R27.1)
PCIE_I225_GF_0_N: 01-PCIe (C47.2), 08-I225-1 (U5.24)
PCIE_I225_GF_0_P: 01-PCIe (C46.2), 08-I225-1 (U5.25)
PCIE_PERST: 01-PCIe (R22.1 R68.2), 07-General I2C Devices (R121.1), 08-I225-1 (U5.13), 10-DPLL-1 (R59.1), 15-M2_GNSS (J2.50 J2.67)
SCL: 07-General I2C Devices (R124.1 U13.22), 08-I225-1 (P3.3 R43.1)
SDA: 07-General I2C Devices (R123.1 U13.23), 08-I225-1 (P3.5 R42.1), 15-M2_GNSS (R103.1)
SFP1_SCL: 05-Front Panel SFP_1 (J5.P1_5 R4.2), 07-General I2C Devices (U13.5)
SFP1_SDA: 05-Front Panel SFP_1 (J5.P1_4 R3.2), 07-General I2C Devices (U13.4)
SFP2_SCL: 05-Front Panel SFP_1 (J5.P2_5 R12.2), 07-General I2C Devices (U13.7)
SFP2_SDA: 05-Front Panel SFP_1 (J5.P2_4 R11.2), 07-General I2C Devices (U13.6)
SFP3_SCL: 06-Front Panel SFP_2 (J5.P3_5 R137.2), 07-General I2C Devices (U13.16)
SFP3_SDA: 06-Front Panel SFP_2 (J5.P3_4 R136.2), 07-General I2C Devices (U13.15)
SFP4_SCL: 06-Front Panel SFP_2 (J5.P4_5 R151.2), 07-General I2C Devices (U13.18)
SFP4_SDA: 06-Front Panel SFP_2 (J5.P4_4 R150.2), 07-General I2C Devices (U13.17)
TOP_SENS_I2C_SCL: 07-General I2C Devices (R118.1 U3.1 U13.9), 11-DPLL-2 (Y2.3), 12-POWER-P12V (U2.4), 13-Power-P3V3 (U28.4), 14-Power-P1V8 (U32.4)
TOP_SENS_I2C_SDA: 07-General I2C Devices (R117.1 U3.3 U13.8), 11-DPLL-2 (Y2.2), 12-POWER-P12V (U2.3), 13-Power-P3V3 (U28.3), 14-Power-P1V8 (U32.3)